# EAGLE design Waveform Generator Board (EAGLE 9.3.0)
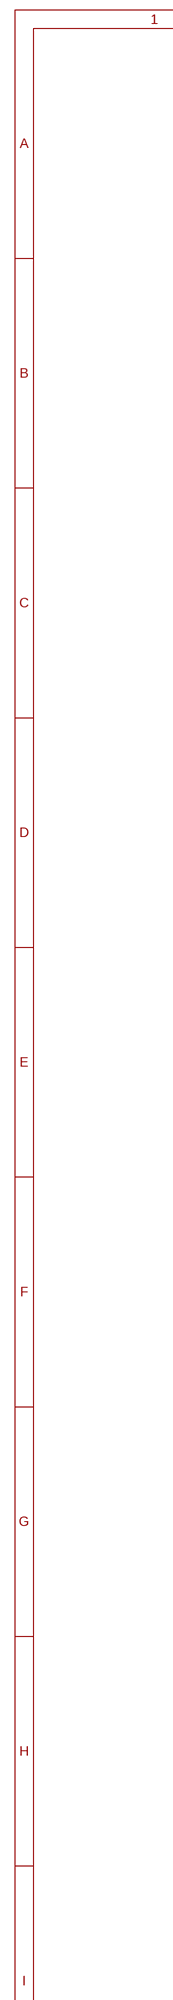
[diagram p0: schematic, sheet 1, part 1 of 2]
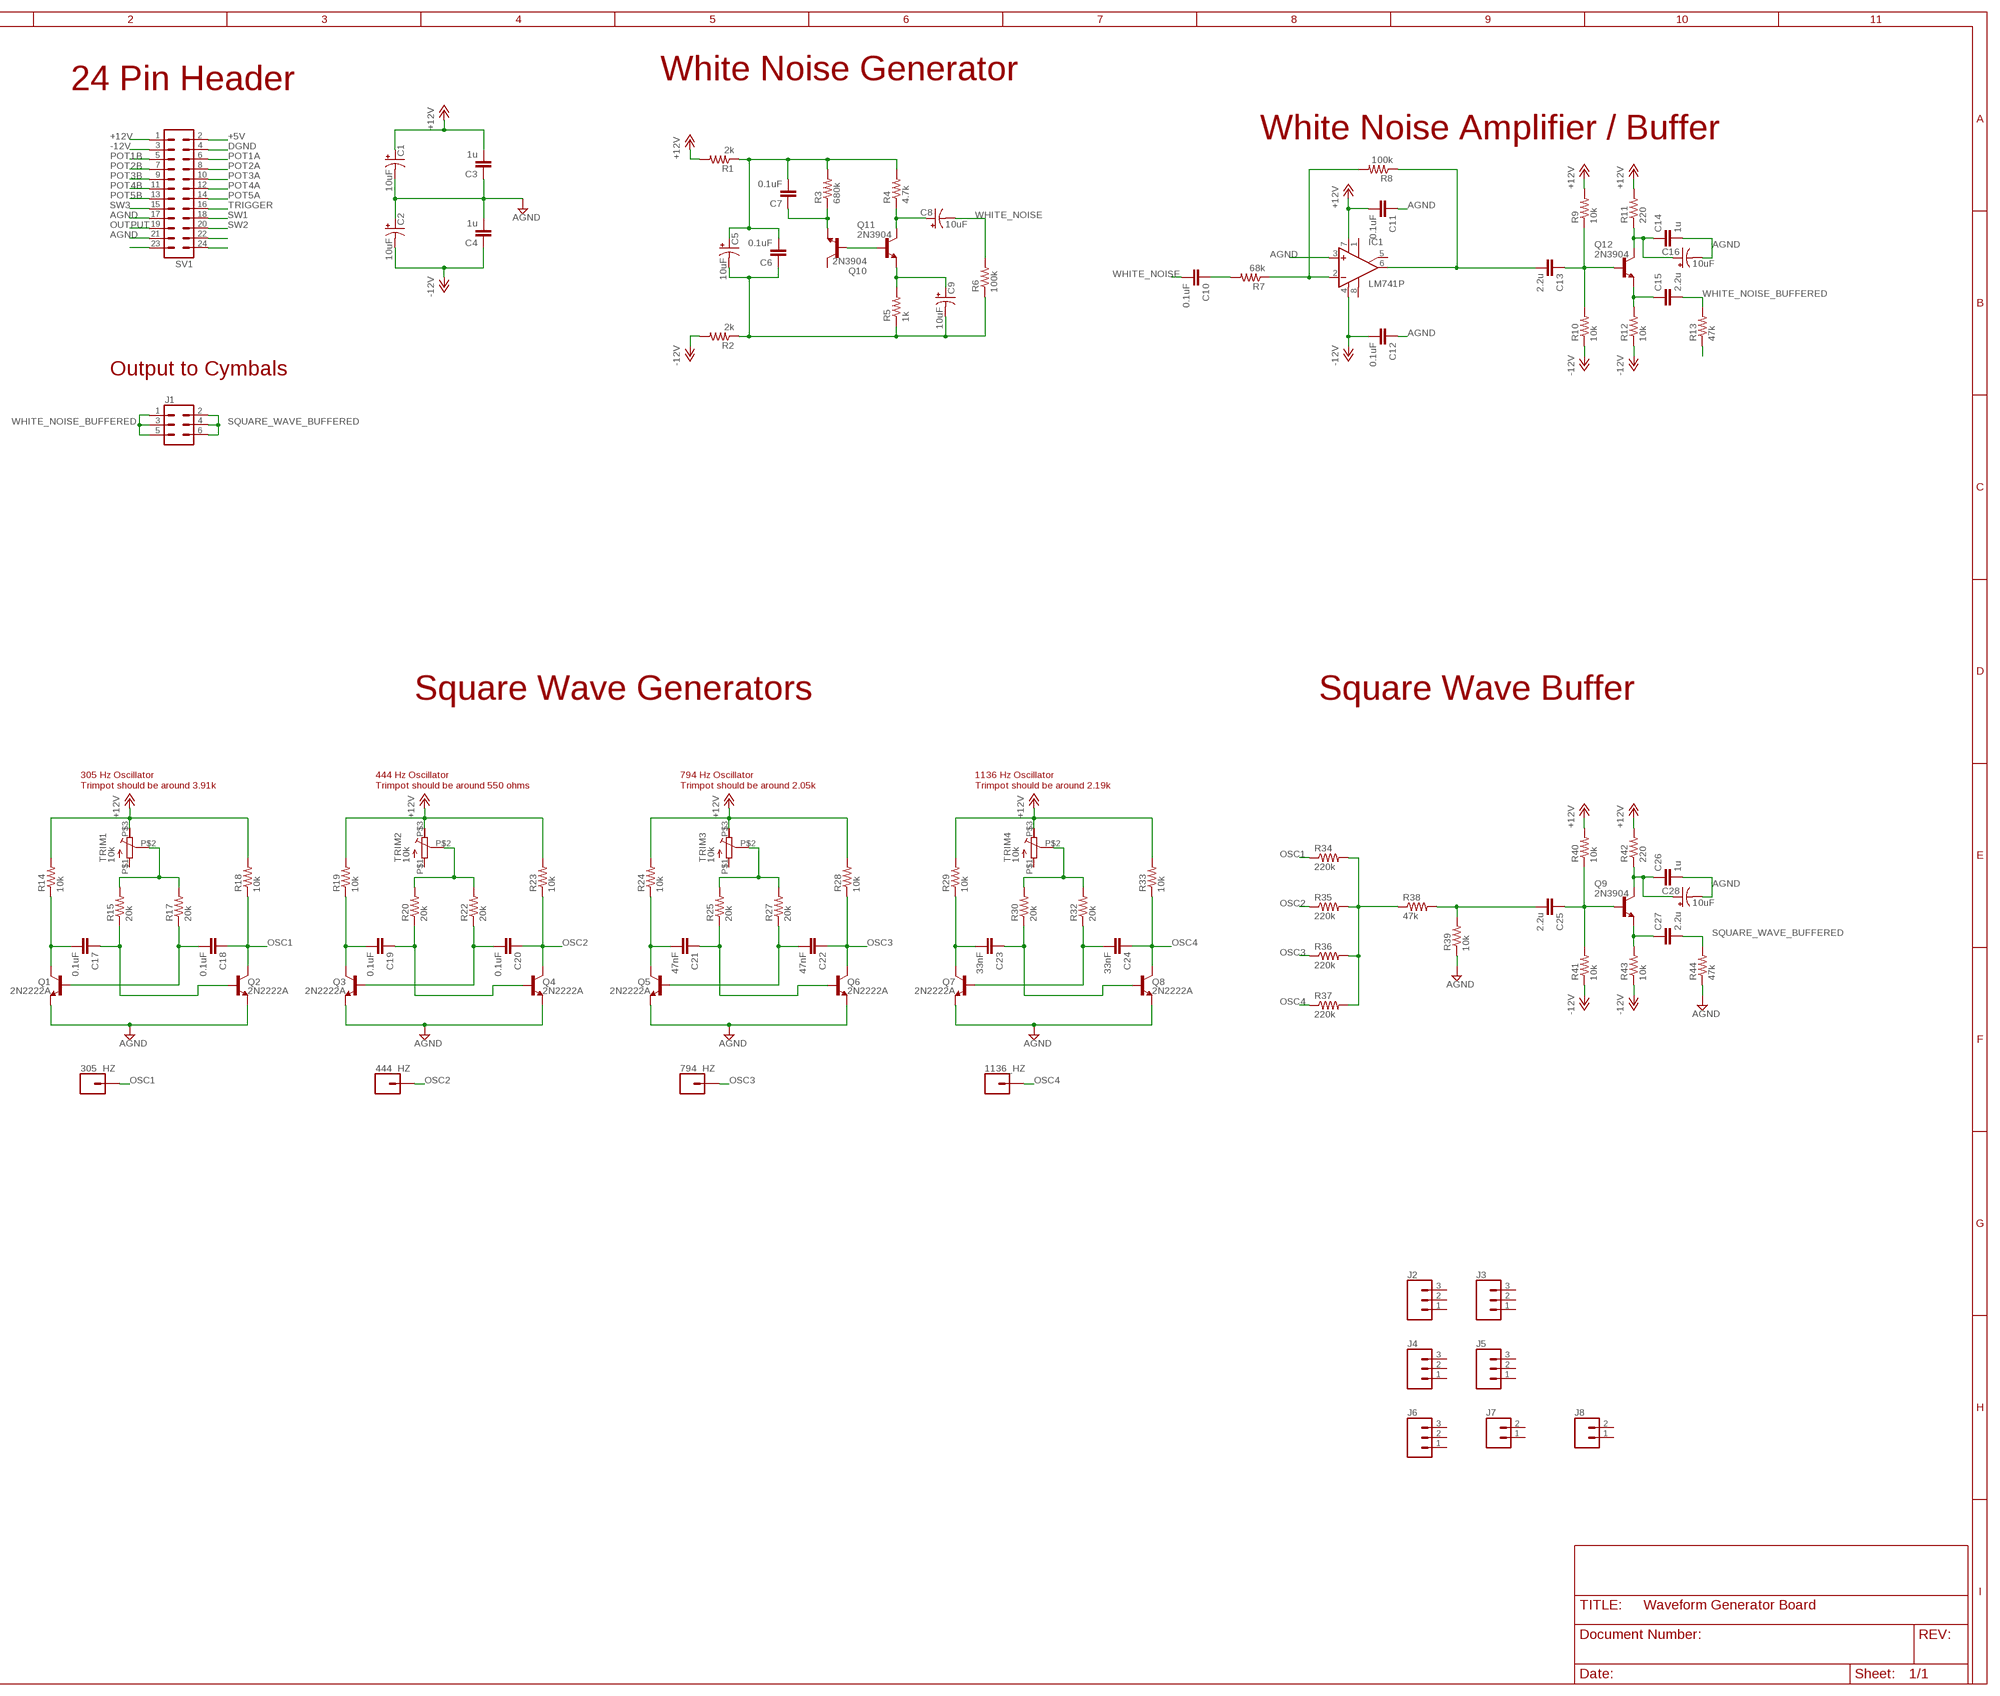
[diagram p1: schematic, sheet 1, part 2 of 2]

## Parts
305_HZ  CONN_01PTH_NO_SILK_KIT  [1X01NS_KIT]
444_HZ  CONN_01PTH_NO_SILK_KIT  [1X01NS_KIT]
794_HZ  CONN_01PTH_NO_SILK_KIT  [1X01NS_KIT]
1136_HZ  CONN_01PTH_NO_SILK_KIT  [1X01NS_KIT]
C1  10uF  CPOL-USE2.5-6  [E2,5-6]
C2  10uF  CPOL-USE2.5-6  [E2,5-6]
C3  1u  C-EU050-024X044  [C050-024X044]
C4  1u  C-EU050-024X044  [C050-024X044]
C5  10uF  CPOL-USE2.5-6  [E2,5-6]
C6  0.1uF  C-EU050-024X044  [C050-024X044]
C7  0.1uF  C-EU050-024X044  [C050-024X044]
C8  10uF  CPOL-USE2.5-6  [E2,5-6]
C9  10uF  CPOL-USE2.5-6  [E2,5-6]
C10  0.1uF  C-EU050-024X044  [C050-024X044]
C11  0.1uF  C-EU050-024X044  [C050-024X044]
C12  0.1uF  C-EU050-024X044  [C050-024X044]
C13  2.2u  C-EU050-024X044  [C050-024X044]
C14  1u  C-EU050-024X044  [C050-024X044]
C15  2.2u  C-EU050-024X044  [C050-024X044]
C16  10uF  CPOL-USE2.5-6  [E2,5-6]
C17  0.1uF  C-EU050-024X044  [C050-024X044]
C18  0.1uF  C-EU050-024X044  [C050-024X044]
C19  0.1uF  C-EU050-024X044  [C050-024X044]
C20  0.1uF  C-EU050-024X044  [C050-024X044]
C21  47nF  C-EU050-024X044  [C050-024X044]
C22  47nF  C-EU050-024X044  [C050-024X044]
C23  33nF  C-EU050-024X044  [C050-024X044]
C24  33nF  C-EU050-024X044  [C050-024X044]
C25  2.2u  C-EU050-024X044  [C050-024X044]
C26  1u  C-EU050-024X044  [C050-024X044]
C27  2.2u  C-EU050-024X044  [C050-024X044]
C28  10uF  CPOL-USE2.5-6  [E2,5-6]
IC1  LM741P  [DIL08]
J1  CONN_03X2NO_SILK  [2X3-NS]
J2  CONN_031X03_NO_SILK  [1X03_NO_SILK]
J3  CONN_031X03_NO_SILK  [1X03_NO_SILK]
J4  CONN_031X03_NO_SILK  [1X03_NO_SILK]
J5  CONN_031X03_NO_SILK  [1X03_NO_SILK]
J6  CONN_031X03_NO_SILK  [1X03_NO_SILK]
J7  CONN_021X02_NO_SILK  [1X02_NO_SILK]
J8  CONN_021X02_NO_SILK  [1X02_NO_SILK]
Q1  2N2222A  TRANS_NPN-P2N2222A  [TO-92]
Q2  2N2222A  TRANS_NPN-P2N2222A  [TO-92]
Q3  2N2222A  TRANS_NPN-P2N2222A  [TO-92]
Q4  2N2222A  TRANS_NPN-P2N2222A  [TO-92]
Q5  2N2222A  TRANS_NPN-P2N2222A  [TO-92]
Q6  2N2222A  TRANS_NPN-P2N2222A  [TO-92]
Q7  2N2222A  TRANS_NPN-P2N2222A  [TO-92]
Q8  2N2222A  TRANS_NPN-P2N2222A  [TO-92]
Q9  2N3904  [TO92]
Q10  2N3904  [TO92]
Q11  2N3904  [TO92]
Q12  2N3904  [TO92]
R1  2k  R-US_0207/7  [0207/7]
R2  2k  R-US_0207/7  [0207/7]
R3  680k  R-US_0207/7  [0207/7]
R4  4.7k  R-US_0207/7  [0207/7]
R5  1k  R-US_0207/7  [0207/7]
R6  100k  R-US_0207/7  [0207/7]
R7  68k  R-US_0207/7  [0207/7]
R8  100k  R-US_0207/7  [0207/7]
R9  10k  R-US_0207/7  [0207/7]
R10  10k  R-US_0207/7  [0207/7]
R11  220  R-US_0207/7  [0207/7]
R12  10k  R-US_0207/7  [0207/7]
R13  47k  R-US_0207/7  [0207/7]
R14  10k  R-US_0207/7  [0207/7]
R15  20k  R-US_0207/7  [0207/7]
R17  20k  R-US_0207/7  [0207/7]
R18  10k  R-US_0207/7  [0207/7]
R19  10k  R-US_0207/7  [0207/7]
R20  20k  R-US_0207/7  [0207/7]
R22  20k  R-US_0207/7  [0207/7]
R23  10k  R-US_0207/7  [0207/7]
R24  10k  R-US_0207/7  [0207/7]
R25  20k  R-US_0207/7  [0207/7]
R27  20k  R-US_0207/7  [0207/7]
R28  10k  R-US_0207/7  [0207/7]
R29  10k  R-US_0207/7  [0207/7]
R30  20k  R-US_0207/7  [0207/7]
R32  20k  R-US_0207/7  [0207/7]
R33  10k  R-US_0207/7  [0207/7]
R34  220k  R-US_0207/7  [0207/7]
R35  220k  R-US_0207/7  [0207/7]
R36  220k  R-US_0207/7  [0207/7]
R37  220k  R-US_0207/7  [0207/7]
R38  47k  R-US_0207/7  [0207/7]
R39  10k  R-US_0207/7  [0207/7]
R40  10k  R-US_0207/7  [0207/7]
R41  10k  R-US_0207/7  [0207/7]
R42  220  R-US_0207/7  [0207/7]
R43  10k  R-US_0207/7  [0207/7]
R44  47k  R-US_0207/7  [0207/7]
SV1  MA12-2  [MA12-2]
TRIM1  10k  10K_TRIMMER  [10K_TRIM]
TRIM2  10k  10K_TRIMMER  [10K_TRIM]
TRIM3  10k  10K_TRIMMER  [10K_TRIM]
TRIM4  10k  10K_TRIMMER  [10K_TRIM]

## Nets
+5V: SV1.2
+12V: C1.+ C3.2 C11.2 IC1.7(V+) R1.2 R9.2 R11.2 R14.2 R18.2 R19.2 R23.2 R24.2 R28.2 R29.2 R33.2 R40.2 R42.2 SV1.1 TRIM1.P$3(E) TRIM2.P$3(E) TRIM3.P$3(E) TRIM4.P$3(E)
-12V: C2.- C4.1 C12.2 IC1.4(V-) R2.2 R10.1 R12.1 R41.1 R43.1 SV1.3
AGND: C1.- C2.+ C3.1 C4.2 C11.1 C12.1 C14.2 C16.- C26.2 C28.- IC1.3(+IN) Q1.3(E) Q2.3(E) Q3.3(E) Q4.3(E) Q5.3(E) Q6.3(E) Q7.3(E) Q8.3(E) R13.1 R39.1 R44.1 SV1.17 SV1.21
DGND: SV1.4
N$2: C13.1 Q12.2(B) R9.1 R10.2
N$3: C15.1 Q12.3(E) R12.2
N$4: C14.1 C16.+ Q12.1(C) R11.1
N$5: C9.+ Q11.3(E) R5.2
N$6: C5.+ C6.2 C7.2 R1.1 R3.2 R4.2
N$9: C13.2 IC1.6(OUT) R8.1
N$11: C17.2 Q1.1(C) R14.1
N$12: C17.1 Q2.2(B) R15.1
N$13: C18.2 Q1.2(B) R17.1
N$15: R15.2 R17.2 TRIM1.P$2(S)
N$16: C19.2 Q3.1(C) R19.1
N$17: Q10.2(B) Q11.2(B)
N$18: C19.1 Q4.2(B) R20.1
N$19: C20.2 Q3.2(B) R22.1
N$20: C7.1 Q10.3(E) R3.1
N$21: C5.- C6.1 C9.- R2.1 R5.1 R6.1
N$22: R34.2 R35.2 R36.2 R37.2 R38.1
N$23: IC1.2(-IN) R7.1 R8.2
N$24: SV1.23
N$25: SV1.24
N$26: SV1.22
N$28: C10.1 R7.2
N$29: R20.2 R22.2 TRIM2.P$2(S)
N$30: C8.+ Q11.1(C) R4.1
N$31: C21.2 Q5.1(C) R24.1
N$35: C21.1 Q6.2(B) R25.1
N$44: C22.2 Q5.2(B) R27.1
N$54: R25.2 R27.2 TRIM3.P$2(S)
N$55: C23.2 Q7.1(C) R29.1
N$56: C23.1 Q8.2(B) R30.1
N$57: C24.2 Q7.2(B) R32.1
N$58: C25.2 R38.2 R39.2
N$59: R30.2 R32.2 TRIM4.P$2(S)
N$63: C25.1 Q9.2(B) R40.1 R41.2
N$71: C27.1 Q9.3(E) R43.2
N$72: C26.1 C28.+ Q9.1(C) R42.1
OSC1: 305_HZ.1 C18.1 Q2.1(C) R18.1 R34.1
OSC2: 444_HZ.1 C20.1 Q4.1(C) R23.1 R35.1
OSC3: 794_HZ.1 C22.1 Q6.1(C) R28.1 R36.1
OSC4: 1136_HZ.1 C24.1 Q8.1(C) R33.1 R37.1
OUTPUT: SV1.19
POT1A: SV1.6
POT1B: SV1.5
POT2A: SV1.8
POT2B: SV1.7
POT3A: SV1.10
POT3B: SV1.9
POT4A: SV1.12
POT4B: SV1.11
POT5A: SV1.14
POT5B: SV1.13
SQUARE_WAVE_BUFFERED: C27.2 J1.2 J1.4 J1.6 R44.2
SW1: SV1.18
SW2: SV1.20
SW3: SV1.15
TRIGGER: SV1.16
WHITE_NOISE: C8.- C10.2 R6.2
WHITE_NOISE_BUFFERED: C15.2 J1.1 J1.3 J1.5 R13.2
Unconnected: IC1.1(ON1) IC1.5(ON2) IC1.8(OPT) J2.1 J2.2 J2.3 J3.1 J3.2 J3.3 J4.1 J4.2 J4.3 J5.1 J5.2 J5.3 J6.1 J6.2 J6.3 J7.1 J7.2 J8.1 J8.2 Q10.1(C) TRIM1.P$1(A) TRIM2.P$1(A) TRIM3.P$1(A) TRIM4.P$1(A)

## Notes on the sheet
- 24 Pin Header | White Noise Generator
- White Noise Amplifier / Buffer
- Output to Cymbals
- Square Wave Generators | Square Wave Buffer
- 305 Hz Oscillator
  Trimpot should be around 3.91k
- 444 Hz Oscillator
  Trimpot should be around 550 ohms
- 794 Hz Oscillator
  Trimpot should be around 2.05k
- 1136 Hz Oscillator
  Trimpot should be around 2.19k

## Library data of the parts
305_HZ 444_HZ 794_HZ 1136_HZ = SparkFun-Connectors:CONN_01: Single connection point. Often used as Generic Header-pin footprint for 0.1 inch spaced/style header connections On any of the 0.1 inch spaced packages, you can populate with these: Break Away Headers - Straight <https://www.sparkfun.com/products/116> (PRT-00116) Break Away Male Headers - Right Angle <https://www.sparkfun.com/products/553> (PRT-00553) Female Headers <https://www.sparkfun.com/products/115> (PRT-00115) Break Away Headers - Machine Pin <https://www.sparkfun.com/products/117> (PRT-00117) Break Away Female Headers - Swiss Machine Pin <https://www.sparkfun.com/products/743> (PRT-00743) This device is also useful as a general connection point to wire up your design to another part of your project. Our various solder wires solder well into these plated through hole pads. Hook-Up Wire - Assortment (Stranded, 22 AWG) <https://www.sparkfun.com/products/11375> (PRT-11375) Hook-Up Wire - Assortment (Solid Core, 22 AWG) <https://www.sparkfun.com/products/11367> (PRT-11367) View the entire wire category on our website here <https://www.sparkfun.com/categories/141> Special notes: SMTSO-256-ET is a "flush mount" nut for a 4-40 screw. We mostly use this on specialty testbeds; it is a nice way to connect hardware to your PCB at an adjustable hieght. Also note, the SNAP packages are for using a snappable style connector. We sell a baggie of snaps and they are also used on two LilyPad designs: Snap Assortment - 30 pack (male and female) <https://www.sparkfun.com/products/11347> (DEV-11347) LilyPad Arduino SimpleSnap <https://www.sparkfun.com/products/10941> (DEV-10941) LilyPad SimpleSnap Protoboard <https://www.sparkfun.com/products/10940> (DEV-10940)
C1 C2 C5 C8 C9 C16 C28 = rcl:CPOL-US: POLARIZED CAPACITOR, American symbol; SPICEPREFIX: C
C3 C4 C6 C7 C10-C15 C17-C27 = resistor:C-EU: CAPACITOR, European symbol
IC1 = linear:*741: OP AMP
J1 = SparkFun-Connectors:CONN_03X2: Multi connection point. Often used as Generic Header-pin footprint for 0.1 inch spaced/style header connections You can populate with any combo of single row headers, but if you'd like an exact match, check these: Header - 2x3 (Male, 0.1") <https://www.sparkfun.com/products/12807> (PRT-12807) Header - 2x3 (Female, 0.1") <https://www.sparkfun.com/products/13010> (PRT-13010) 2x3 Pin Shrouded Header <https://www.sparkfun.com/products/10877> (PRT-10877) On any of the 0.1 inch spaced packages, you can populate with these: Break Away Headers - Straight <https://www.sparkfun.com/products/116> (PRT-00116) Break Away Male Headers - Right Angle <https://www.sparkfun.com/products/553> (PRT-00553) Female Headers <https://www.sparkfun.com/products/115> (PRT-00115) Break Away Headers - Machine Pin <https://www.sparkfun.com/products/117> (PRT-00117) Break Away Female Headers - Swiss Machine Pin <https://www.sparkfun.com/products/743> (PRT-00743) Special note: the shrouded connector mates well with our 3x2 ribbon cables: Ribbon Crimp Connector - 6-pin (2x3, Female) <https://www.sparkfun.com/products/10651> (PRT-10651) Ribbon Cable - 6 wire (15ft) <https://www.sparkfun.com/products/10646> (PRT-10646)
J2-J6 = SparkFun-Connectors:CONN_03: Multi connection point. Often used as Generic Header-pin footprint for 0.1 inch spaced/style header connections On any of the 0.1 inch spaced packages, you can populate with these: Break Away Headers - Straight <https://www.sparkfun.com/products/116> (PRT-00116) Break Away Male Headers - Right Angle <https://www.sparkfun.com/products/553> (PRT-00553) Female Headers <https://www.sparkfun.com/products/115> (PRT-00115) Break Away Headers - Machine Pin <https://www.sparkfun.com/products/117> (PRT-00117) Break Away Female Headers - Swiss Machine Pin <https://www.sparkfun.com/products/743> (PRT-00743) Stackable Header - 3 Pin (Female, 0.1") <https://www.sparkfun.com/products/13875> (PRT-13875) For SCREWTERMINALS and SPRING TERMINALS visit here: Screw Terimnals on SparkFun.com <https://www.sparkfun.com/search/results?term=Screw+Terminals> (5mm/3.5mm/2.54mm spacing) This device is also useful as a general connection point to wire up your design to another part of your project. Our various solder wires solder well into these plated through hole pads. Hook-Up Wire - Assortment (Stranded, 22 AWG) <https://www.sparkfun.com/products/11375> (PRT-11375) Hook-Up Wire - Assortment (Solid Core, 22 AWG) <https://www.sparkfun.com/products/11367> (PRT-11367) View the entire wire category on our website here <https://www.sparkfun.com/categories/141> Special notes: Molex polarized connector foot print use with SKU : PRT-08232 with associated crimp pins and housings.
J7 J8 = SparkFun-Connectors:CONN_02: Multi connection point. Often used as Generic Header-pin footprint for 0.1 inch spaced/style header connections On any of the 0.1 inch spaced packages, you can populate with these: Break Away Headers - Straight <https://www.sparkfun.com/products/116> (PRT-00116) Break Away Male Headers - Right Angle <https://www.sparkfun.com/products/553> (PRT-00553) Female Headers <https://www.sparkfun.com/products/115> (PRT-00115) Break Away Headers - Machine Pin <https://www.sparkfun.com/products/117> (PRT-00117) Break Away Female Headers - Swiss Machine Pin <https://www.sparkfun.com/products/743> (PRT-00743) For SCREWTERMINALS and SPRING TERMINALS visit here: Screw Terimnals on SparkFun.com <https://www.sparkfun.com/search/results?term=Screw+Terminals> (5mm/3.5mm/2.54mm spacing) This device is also useful as a general connection point to wire up your design to another part of your project. Our various solder wires solder well into these plated through hole pads. Hook-Up Wire - Assortment (Stranded, 22 AWG) <https://www.sparkfun.com/products/11375> (PRT-11375) Hook-Up Wire - Assortment (Solid Core, 22 AWG) <https://www.sparkfun.com/products/11367> (PRT-11367) View the entire wire category on our website here <https://www.sparkfun.com/categories/141> Special notes: Molex polarized connector foot print use with: PRT-08233 with associated crimp pins and housings. 2.54_SCREWTERM for use with PRT-10571. 3.5mm Screw Terminal footprints for PRT-08084 5mm Screw Terminal footprints for use with PRT-08432
Q1-Q8 = SparkFun-DiscreteSemi:TRANS_NPN: NPN transistor Current controlled devices typically used to amplify current or used as a switch. BC547 - COM-08928 <http://www.sparkfun.com/products/8928> (TO-92 45V 100mA) (1.Collector 2.Base 3.Emitter) 2N3904 - COM-00521 <http://www.sparkfun.com/products/521> (TO-92 40V 200mA) (1.Emitter 2.Base 3.Collector) P2N2222A - COM-12852 <http://www.sparkfun.com/products/12852> (TO-92 40V 600mA) (1.Collector 2.Base 3.Emitter); PROD_ID: TRANS-09536; VALUE: 600mA/40V
Q9-Q12 = transistor:2N3904: NPN TRANSISTOR
R1-R15 R17-R20 R22-R25 R27-R30 R32-R44 = rcl:R-US_: RESISTOR, American symbol; SPICEPREFIX: R
SV1 = con-lstb:MA12-2: PIN HEADER; OC_FARNELL: unknown; OC_NEWARK: unknown
TRIM1-TRIM4 = Capstone:10K_TRIMMER

## Board
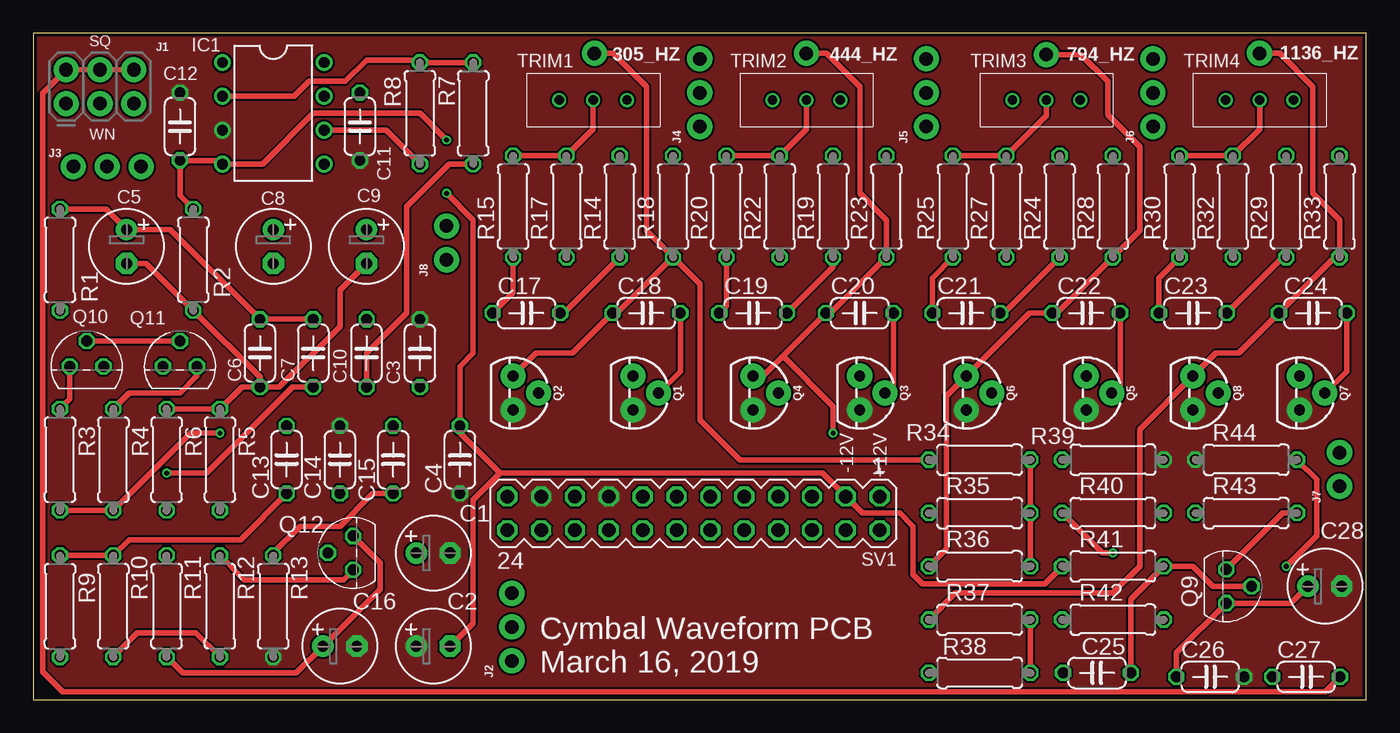
[diagram p2: board, top side]
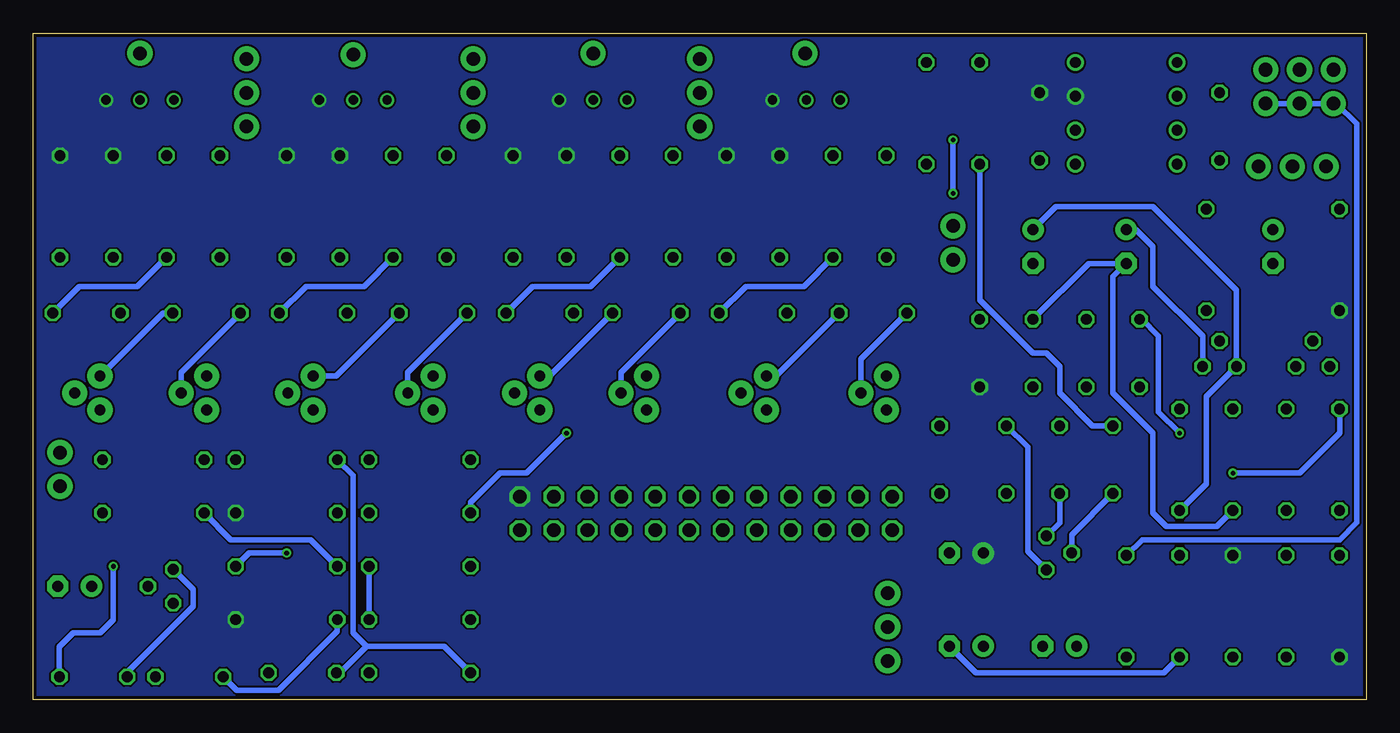
[diagram p3: board, bottom side, seen from below]

Size 100 x 50 mm. Coordinates in mm from the lower left corner, seen from the top.
Outline: 0,0 100,0 100,50 0,50 0,0
Copper layers (1*16): Top 0.035mm / dielectric 1.5mm / Bottom 0.035mm
Design rules "JLCPCB2Layer": minimum track width 6mil, minimum drill 10mil, track to track 6mil, track to pad 6mil, pad to pad 6mil, via to via 6mil, smd to smd 0mil, copper to edge 10mil, drill to drill 10mil, minimum pad ring 6mil, minimum via ring 6mil, stop-mask expansion 2mil, vias tented up to drill 100mil, thermal gap 10mil

### Footprints (pad centres in the part's own frame; a part is rotated, then mirrored left to right if it is on the bottom)
1X01NS_KIT = drill 1.016 pad 1.88: 1 0,0
E2,5-6 = drill 0.813 pad 1.6: + -1.27,0 | drill 0.813 pad 1.6 octagon: - 1.27,0
C050-024X044 = drill 0.813 octagon: 1 -2.54,0; 2 2.54,0
DIL08 = drill 0.813 pad 1.27: 1 -3.81,-3.81; 2 -1.27,-3.81; 3 1.27,-3.81; 4 3.81,-3.81; 5 3.81,3.81; 6 1.27,3.81; 7 -1.27,3.81; 8 -3.81,3.81
2X3-NS = drill 1.016 pad 1.88: 1 -2.54,-1.27; 2 -2.54,1.27; 3 0,-1.27; 4 0,1.27; 5 2.54,-1.27; 6 2.54,1.27
1X03_NO_SILK = drill 1.016 pad 1.88: 1 0,0; 2 2.54,0; 3 5.08,0
1X02_NO_SILK = drill 1.016 pad 1.88: 1 0,0; 2 2.54,0
TO-92 = drill 0.813 pad 1.88: 1 -1.27,0; 2 0,1.905; 3 1.27,0
TO92 = drill 0.813 octagon: 1 1.27,0; 2 0,1.905; 3 -1.27,0
0207/7 = drill 0.813 octagon: 1 -3.81,0; 2 3.81,0
MA12-2 = drill 1.016 octagon: 1 -13.97,-1.27; 2 -13.97,1.27; 3 -11.43,-1.27; 4 -11.43,1.27; 5 -8.89,-1.27; 6 -8.89,1.27; 7 -6.35,-1.27; 8 -6.35,1.27; 9 -3.81,-1.27; 10 -3.81,1.27; 11 -1.27,-1.27; 12 -1.27,1.27; 13 1.27,-1.27; 14 1.27,1.27; 15 3.81,-1.27; 16 3.81,1.27; 17 6.35,-1.27; 18 6.35,1.27; 19 8.89,-1.27; 20 8.89,1.27; 21 11.43,-1.27; 22 11.43,1.27; 23 13.97,-1.27; 24 13.97,1.27
10K_TRIM = drill 0.7: P$1 2.46,2; P$2 5,2; P$3 7.54,2

### Placement (x,y rotation side)
305_HZ  42.1,48.5 0 top
444_HZ  58,48.5 0 top
794_HZ  76,48.4 0 top
1136_HZ  92,48.5 0 top
C1  30,11 0 top
C2  30,4 0 top
C3  29,26 270 top
C4  32,18 270 top
C5  7,34 270 top
C6  17,26 90 top
C7  21,26 90 top
C8  18,34 270 top
C9  25,34 270 top
C10  25,26 90 top
C11  24.5,43 90 top
C12  11,43 270 top
C13  19,18 90 top
C14  23,18 90 top
C15  27,18 270 top
C16  23,4 0 top
C17  37,29 0 top
C18  46,29 0 top
C19  54,29 0 top
C20  62,29 0 top
C21  70,29 0 top
C22  79,29 0 top
C23  87,29 0 top
C24  96,29 0 top
C25  79.8,2 180 top
C26  88.3,1.7 0 top
C27  95.5,1.7 0 top
C28  96.9,8.5 0 top
IC1  18,44 270 top
J1  5,46 0 top
J2  35.9,2.9 90 top
J3  3,40 0 top
J4  50,43 90 top
J5  67,43 90 top
J6  84,43 90 top
J7  98,16 90 top
J8  31,33 90 top
Q1  45,23 270 top
Q2  36,23 270 top
Q3  62,23 270 top
Q4  54,23 270 top
Q5  79,23 270 top
Q6  70,23 270 top
Q7  95,23 270 top
Q8  87,23 270 top
Q9  89.5,8.5 270 top
Q10  4,25 0 top
Q11  11,25 0 top
Q12  24,11 90 top
R1  2,33 270 top
R2  12,33 90 top
R3  2,18 270 top
R4  6,18 270 top
R5  14,18 270 top
R6  10,18 270 top
R7  33,44 270 top
R8  29,44 90 top
R9  2,7 270 top
R10  6,7 90 top
R11  10,7 90 top
R12  14,7 90 top
R13  18,7 90 top
R14  44,37 90 top
R15  36,37 90 top
R17  40,37 90 top
R18  48,37 90 top
R19  60,37 90 top
R20  52,37 90 top
R22  56,37 90 top
R23  64,37 90 top
R24  77,37 90 top
R25  69,37 90 top
R27  73,37 90 top
R28  81,37 90 top
R29  94,37 90 top
R30  86,37 90 top
R32  90,37 90 top
R33  98,37 90 top
R34  71,18 0 top
R35  71,14 0 top
R36  71,10 0 top
R37  71,6 0 top
R38  71,2 180 top
R39  81,18 180 top
R40  81,14 0 top
R41  81,10 0 top
R42  81,6 0 top
R43  91,14 0 top
R44  91,18 0 top
SV1  49.53,13.97 180 top
TRIM1  37,43 0 top
TRIM2  53,43 0 top
TRIM3  71,43 0 top
TRIM4  87,43 0 top

### Tracks (layer width: path | path; a pad name or v marks a point on that pad's centre or on a via)
+12V
  pour Bottom (no thermals): -2,52 102,52 102,-2 -2,-2
-12V  (via drill 0.35)
  Top 0.406: R10.1 7.81,5 12.19,5 R12.1 | R2.2 11,37.81 C12.2 13.92,40.46 IC1.4 17.19,40.19 21,44 29,44 v31,42 | R41.1 75.89,8.7 66.7,8.7 66,9.4 66,13 65,14 62.2,14 SV1.3 59.2,17 35,17 | 35,17 32,20 C4.1 32,25 33,26 33,36 v31,38 | 35,17 33,15 33,5.73 C2.-
  Bottom 0.406: R41.1 79.19,12 85.19,12 R43.1 | R12.1 15.19,2 29.27,2 C2.- | v31,42 v31,38
AGND
  pour Top (no thermals): -1,51 -1,-1 101,-1 101,51
N$2
  Top 0.406: R9.1 R10.2 7.19,12 15.54,12 C13.1
  Bottom 0.406: C13.1 22.09,12.37 Q12.2
N$3
  Top 0.406: R12.2 15.81,9 23.27,9 Q12.3
  Bottom 0.406: Q12.3 25.4,11.13 25.4,18.94 C15.1
N$4
  Top 0.406: Q12.1 26,10.27 26,8.27 C16.+ 19.73,2 11.19,2 R11.1
  Bottom 0.406: C14.1 23,13.27 Q12.1
N$5
  Bottom 0.406: R5.2 12,16.19 12,22.73 Q11.3 9.73,30.73 16,37 23.27,37 C9.+
N$6  (via drill 0.35)
  Top 0.406: R3.2 R4.2 11.81,20 v14,20 | R1.1 5.46,36.81 C5.+ 10.27,35.27 C6.2 C7.2
  Bottom 0.406: v14,20 15.6,21.6 15.6,27.3 16.84,28.54 C6.2
N$9
  Top 0.406: IC1.6 26.46,42.73 R8.1
  Bottom 0.406: C13.2 20.54,20.54 23,23 23,25 24,26 25,26 29,30 R8.1
N$11
  Top 0.406: R14.1 39.81,29 C17.2
  Bottom 0.406: C17.2 44.27,24.27 Q1.1
N$12
  Top 0.406: R15.1 36,30.54 C17.1
  Bottom 0.406: C17.1 37.91,25.55 Q2.2
N$13
  Top 0.406: C18.2 48.54,24.64 Q1.2
  Bottom 0.406: R17.1 42.19,31 46.54,31 C18.2
N$15
  Top 0.406: R15.2 R17.2 42,42.81 TRIM1.P$2
N$16
  Top 0.406: C19.2 60,32.46 R19.1
  Bottom 0.406: C19.2 61.27,24.27 Q3.1
N$17
  Top 0.406: Q10.2 Q11.2
N$18
  Top 0.406: R20.1 52,29.54 C19.1
  Bottom 0.406: C19.1 55.91,24.55 Q4.2
N$19
  Top 0.406: C20.2 64.54,23.64 Q3.2
  Bottom 0.406: R22.1 58.19,31 62.54,31 C20.2
N$20  (via drill 0.35)
  Top 0.406: R3.1 2.73,22.54 Q10.3 | C7.1 19.46,23.46 13,17 v10,17
  Bottom 0.406: v10,17 5,17 2,20 R3.1
N$21
  Top 0.406: R6.1 R5.1 15.65,23.46 C6.1 | C6.1 18.46,23.46 23,28 23,30.73 C9.- | C5.- 8.46,32.73 R2.1 17,24.19 C6.1
N$22
  Top 0.406: R34.2 R35.2 R36.2 | R37.2 R38.1
  Bottom 0.406: R36.2 R37.2
N$23
  Top 0.406: IC1.2 19.57,45.27 20.7,46.4 23.4,46.4 25,48 28.81,48 R8.2 R7.1
N$28
  Top 0.406: C10.1 25,26 28,29 28,37 31.19,40.19 R7.2
N$29
  Top 0.406: R20.2 R22.2 58,42.81 TRIM2.P$2
N$30
  Top 0.406: R4.1 7.19,23 11,23 12.27,24.27 Q11.1
  Bottom 0.406: Q11.1 12.27,27.27 16,31 16,34 17.27,35.27 C8.+
N$31
  Top 0.406: R24.1 72.81,29 C21.2
  Bottom 0.406: C21.2 77.27,24.27 Q5.1
N$35
  Top 0.406: R25.1 67.46,31.65 C21.1
  Bottom 0.406: C21.1 71.91,24.55 Q6.2
N$44
  Top 0.406: C22.2 81.54,23.64 Q5.2
  Bottom 0.406: R27.1 75.19,31 79.54,31 C22.2
N$54
  Top 0.406: R25.2 R27.2 76,43.81 TRIM3.P$2
N$55
  Top 0.406: R29.1 93.73,33.19 C23.2
  Bottom 0.406: C23.2 90.27,29 Q7.1
N$56
  Top 0.406: R30.1 84.46,31.65 C23.1
  Bottom 0.406: C23.1 88.91,24.55 Q8.2
N$57
  Top 0.406: C24.2 98.54,24.64 Q7.2
  Bottom 0.406: R32.1 92.19,31 96.54,31 C24.2
N$58
  Bottom 0.406: C25.2 77,2 75,4 | R38.2 69.19,4 75,4 | R39.2 76,16.81 76,5 75,4
N$59
  Top 0.406: R30.2 R32.2 92,42.81 TRIM4.P$2
N$63  (via drill 0.35)
  Top 0.406: C25.1 82.34,7.53 R41.2 87,10 88.5,8.5 Q9.2 | R40.1 80.19,11 v81,11
  Bottom 0.406: v81,11 83.81,11 R41.2
N$71
  Top 0.406: R43.2 93.73,14 Q9.3
  Bottom 0.406: Q9.3 88,8.27 88,7 92.96,2.04 C27.1
N$72
  Top 0.406: C26.1 85.76,3.49 Q9.1 94.36,7.23 C28.+
  Bottom 0.406: R42.1 77.19,5.11 81.6,0.7 84.76,0.7 C26.1
OSC1
  Top 0.406: R18.1 43.81,29 C18.1 40.46,26 37.73,26 Q2.1 | R18.1 50,31.19 50,21 53,18 R34.1 | R18.1 46,35.19 46,46 43.5,48.5 305_HZ.1
OSC2  (via drill 0.35)
  Top 0.406: 56.23,25.77 C20.1 59.81,29 R23.1 64,36 62,38 62,46 59.5,48.5 444_HZ.1 | 56.23,25.77 54.73,24.27 Q4.1 | 56.23,25.77 60,22 v60,20
  Bottom 0.406: v60,20 63,17 65,17 67.19,14.81 R35.1
OSC3
  Top 0.406: R36.1 68.5,11.31 68.5,22.77 Q6.1 74.73,29 C22.1 76.81,29 R28.1 83,35.19 83,41.5 80.6,43.9 80.6,46.4 78.6,48.4 794_HZ.1
OSC4
  Top 0.406: R37.1 69.19,8 81,8 83,10 83,20.27 Q8.1 88.73,26 90.46,26 C24.1 97.65,33.19 R33.1 98,36 96,38 96,46 93.5,48.5 1136_HZ.1
SQUARE_WAVE_BUFFERED  (via drill 0.35)
  Top 0.406: C27.2 96.94,0.6 2.2,0.6 0.7,2.1 0.7,45.51 J1.2 J1.4 J1.6 | R44.2 96.3,16.51 96.3,12.3 v94,10
  Bottom 0.406: v94,10 94,6 95,5 97,5 98.04,3.96 C27.2
WHITE_NOISE
  Bottom 0.406: R6.2 11.19,13 15,13 16,14 16,20 19,23 19,31.73 C8.- 20.81,32.73 C10.2
WHITE_NOISE_BUFFERED
  Top 0.406: C15.2 25.46,15.46 23,13 20,13 18,11 R13.2
  Bottom 0.406: R13.2 16.81,12 2,12 0.7,13.3 0.7,43.2 2.23,44.73 J1.1 J1.3 J1.5

### Text on the board
tPlace: SQ | WN | Cymbal Waveform PCB / March 16, 2019
tNames: -12V | +12V